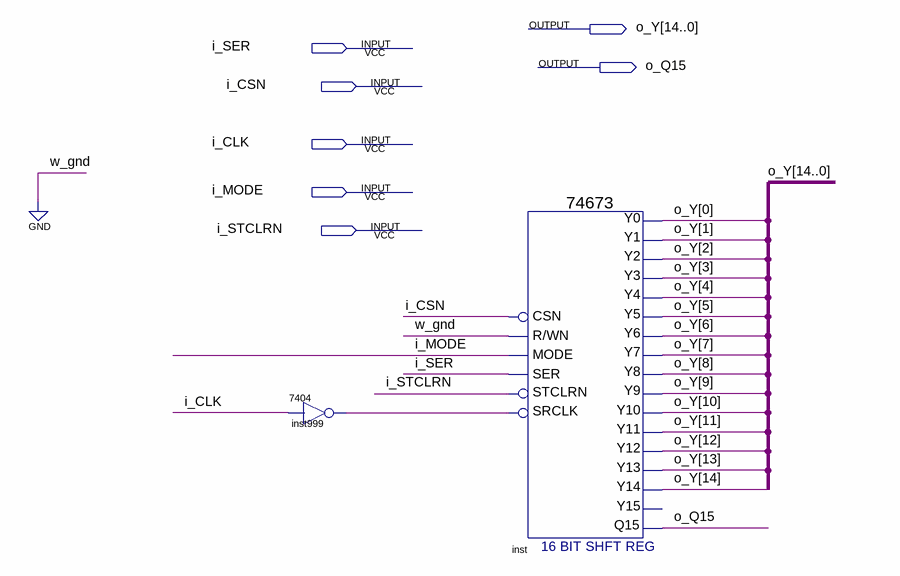
[diagram p0: schematic sheet]
// Quartus schematic ttl74673.bdf as structural Verilog: 2 symbols, 7 pins
module ttl74673 (
  input  i_SER,
  input  i_CSN,
  input  i_CLK,
  input  i_MODE,
  input  i_STCLRN,
  output [14:0] o_Y,
  output o_Q15
);

  wire inst999_1;

  \7404  inst999 (.\2 (i_CLK), .\1 (inst999_1));
  \74673  inst (
    .CSN(i_CSN), .SER(i_SER), .STCLRN(i_STCLRN), .MODE(i_MODE), .\R/WN (1'b0), .SRCLK(inst999_1),
    .Y0(o_Y[0]), .Y2(o_Y[2]), .Y1(o_Y[1]), .Y3(o_Y[3]), .Y4(o_Y[4]), .Y13(o_Y[13]), .Y5(o_Y[5]), .Y6(o_Y[6]),
    .Y10(o_Y[10]), .Y11(o_Y[11]), .Y12(o_Y[12]), .Y7(o_Y[7]), .Y8(o_Y[8]), .Y9(o_Y[9]), .Y14(o_Y[14]),
    .Q15(o_Q15));  // open: Y15
endmodule
